# EAGLE board homeboard28 (EAGLE 6.0)
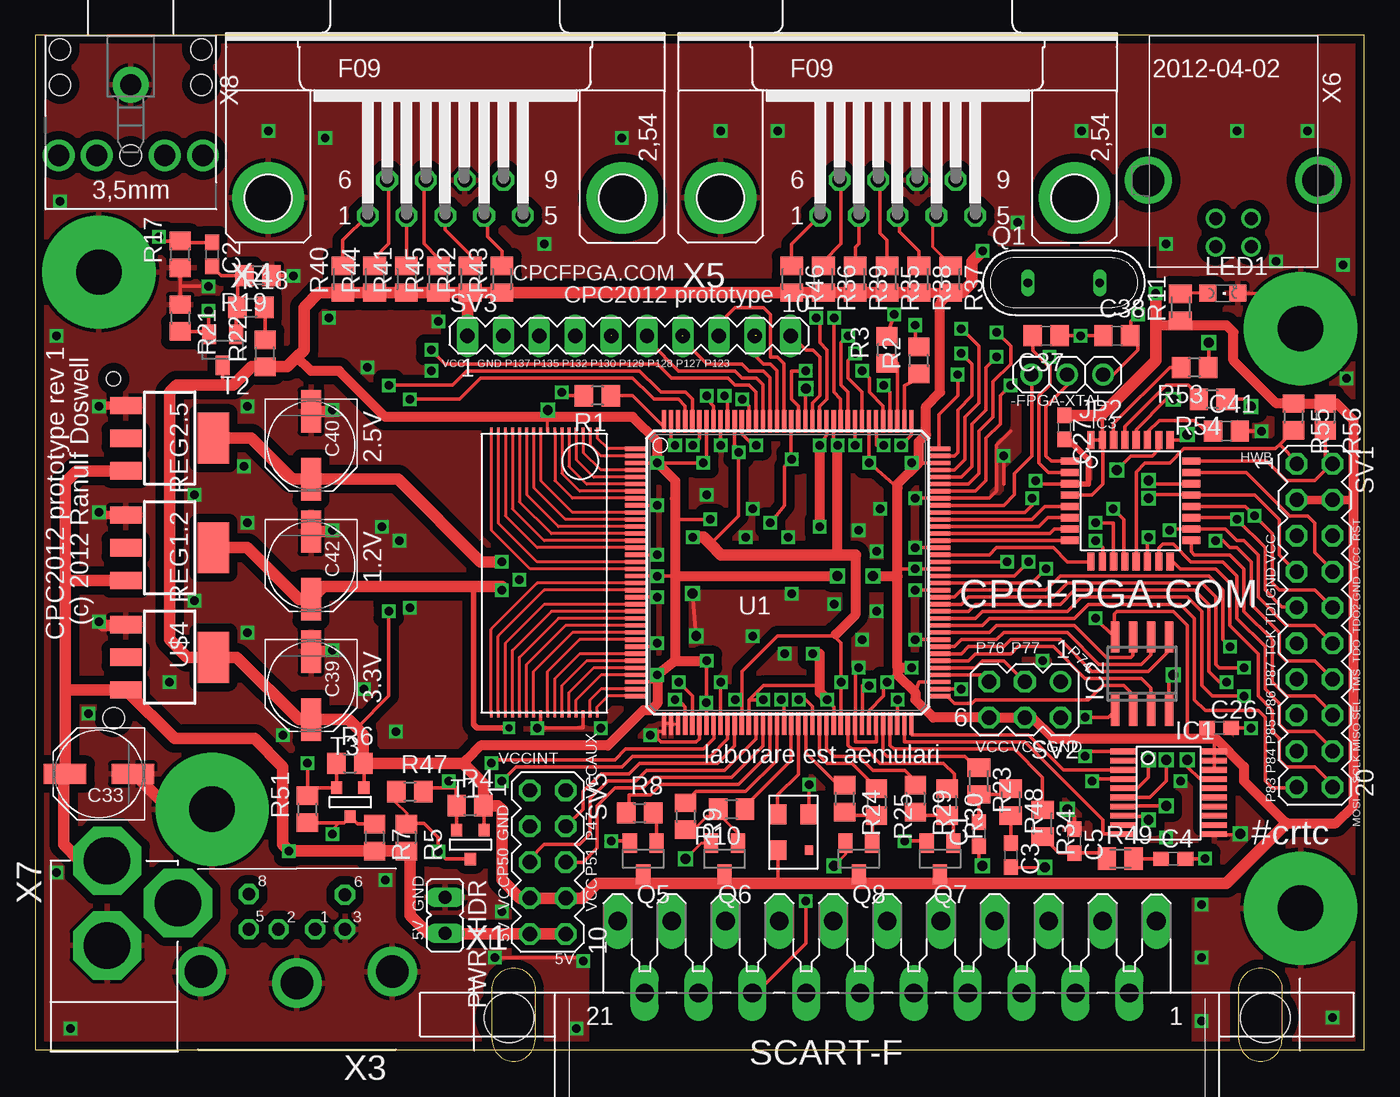
[diagram p3: board, top side]
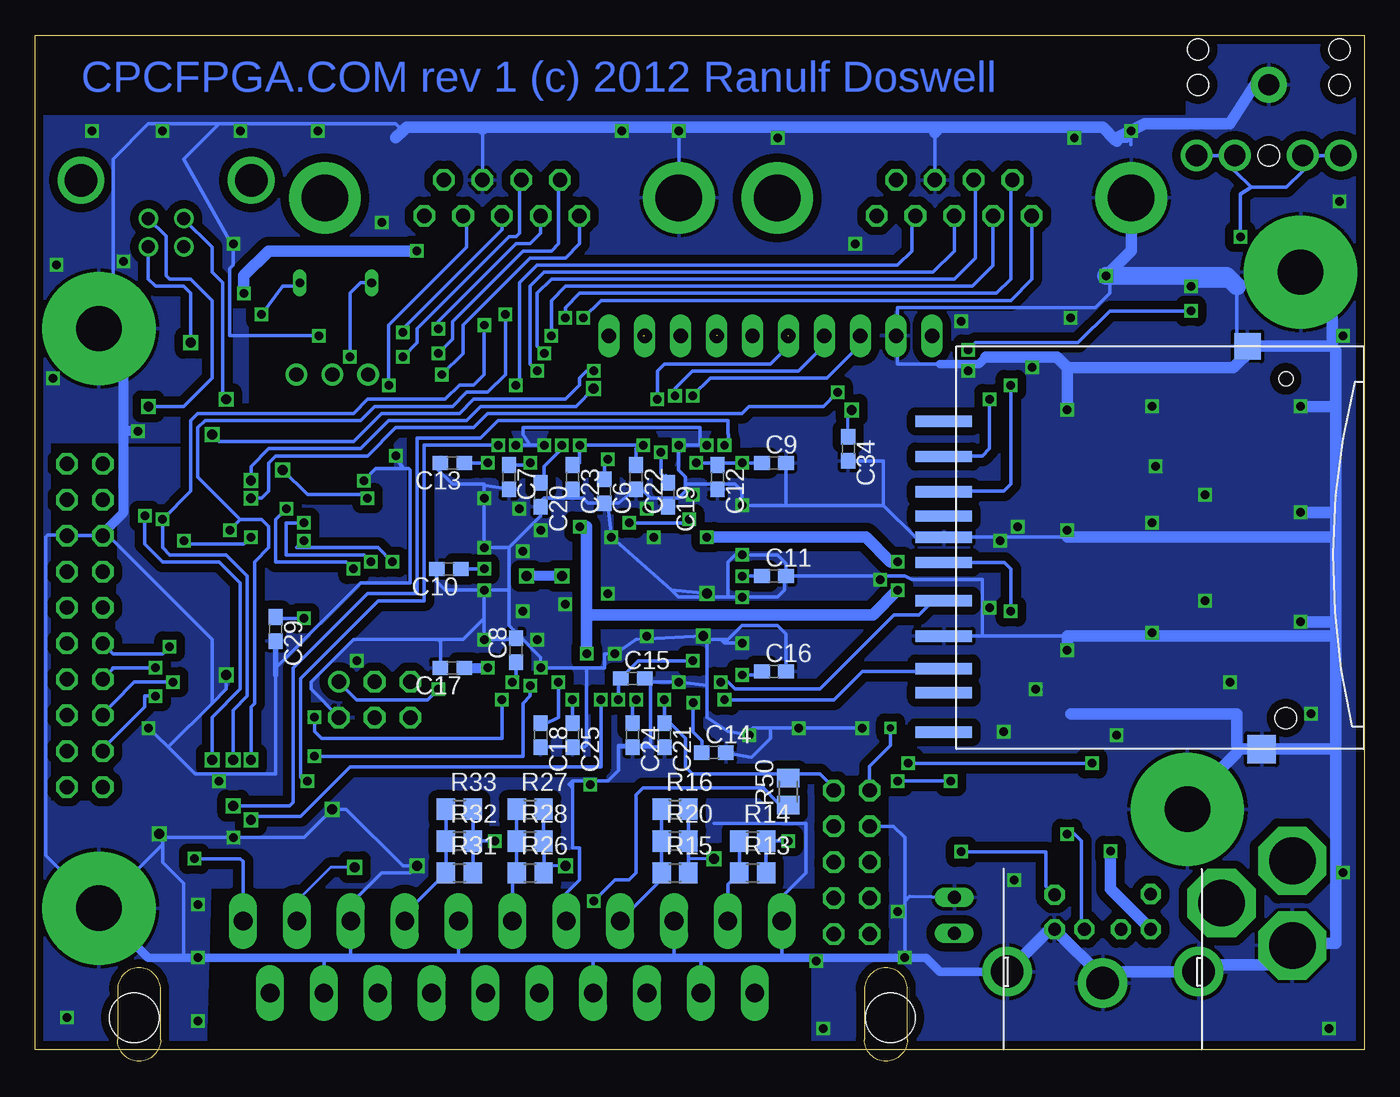
[diagram p4: board, bottom side, seen from below]

Size 94 x 72.58 mm. Coordinates in mm from the lower left corner, seen from the top.
Outline: 0,0.83 94,0.83 94,72.58 0,72.58 0,0.83
Copper layers (1*16): Top 0.0356mm / dielectric 1.5011mm / Bottom 0.0356mm
Design rules: minimum track width 7mil, minimum drill 15mil, track to track 7mil, track to pad 7mil, pad to pad 7mil, via to via 7mil, smd to smd 7mil, copper to edge 15mil, drill to drill 15mil, minimum pad ring 7mil, minimum via ring 7mil, stop-mask expansion 4mil, vias tented up to drill 0mil, thermal gap 10mil
Net classes: 1 power: width 0.6 mm, drill 1.1 mm, clearance 0.4 mm; 2 gnd: width 0.305 mm, drill 0.508 mm, clearance 0.152 mm

## Footprints (pad centres in the part's own frame; a part is rotated, then mirrored left to right if it is on the bottom)
C0603 = smd 1.1 x 1: 1 -0.85,0; 2 0.85,0
PANASONIC_D = smd 3 x 1.4: + 2.4,0; - -2.4,0
C0805 = smd 1.3 x 1.5: 1 -0.95,0; 2 0.95,0
VO20 = smd 0.4 x 1.8: 1 5.85,6.15; 2 5.2,6.15; 3 4.55,6.15; 4 3.9,6.15; 5 3.25,6.15; 6 2.6,6.15; 7 1.95,6.15; 8 1.3,6.15; 9 0.65,6.15; 10 0,6.15; 11 0,-0.3; 12 0.65,-0.3; 13 1.3,-0.3; 14 1.95,-0.3; 15 2.6,-0.3; 16 3.25,-0.3; 17 3.9,-0.3; 18 4.55,-0.3; 19 5.2,-0.3; 20 5.85,-0.3
SO-08 = smd 0.6 x 2.2: 1 -1.905,-2.6; 2 -0.635,-2.6; 3 0.635,-2.6; 4 1.905,-2.6; 5 1.905,2.6; 6 0.635,2.6; 7 -0.635,2.6; 8 -1.905,2.6
TQFP32-08 = smd 1.27 x 0.508: 1 -4.293,2.8; 2 -4.293,2; 3 -4.293,1.2; 4 -4.293,0.4; 5 -4.293,-0.4; 6 -4.293,-1.2; 7 -4.293,-2; 8 -4.293,-2.8; 17 4.293,-2.8; 18 4.293,-2; 19 4.293,-1.2; 20 4.293,-0.4; 21 4.293,0.4; 22 4.293,1.2; 23 4.293,2; 24 4.293,2.8 | smd 0.508 x 1.27: 9 -2.8,-4.293; 10 -2,-4.293; 11 -1.2,-4.293; 12 -0.4,-4.293; 13 0.4,-4.293; 14 1.2,-4.293; 15 2,-4.293; 16 2.8,-4.293; 25 2.8,4.293; 26 2,4.293; 27 1.2,4.293; 28 0.4,4.293; 29 -0.4,4.293; 30 -1.2,4.293; 31 -2,4.293; 32 -2.8,4.293
1X03 = drill 1.016: 1 -2.54,0; 2 0,0; 3 2.54,0
CHIPLED_0805 = smd 1.2 x 1.2: A 0,-1.05; C 0,1.05
JP1 = drill 0.914 long: 1 0,-1.27; 2 0,1.27
QS = drill 0.61 long: 1 -2.54,0; 2 2.54,0
SOT23 = smd 1 x 1.4: 1 -0.95,-1.1; 2 0.95,-1.1; 3 0,1.1
R0805 = smd 1.3 x 1.5: 1 -0.95,0; 2 0.95,0
M0805 = smd 1.3 x 1.6: 1 -0.95,0; 2 0.95,0
SOT223 = smd 1.219 x 2.235: 1 -2.311,-3.099; 2 0,-3.099; 3 2.311,-3.099 | smd 3.6 x 2.2: 4 0,3.099
MA10-2 = drill 1.016 octagon: 1 -11.43,-1.27; 2 -11.43,1.27; 3 -8.89,-1.27; 4 -8.89,1.27; 5 -6.35,-1.27; 6 -6.35,1.27; 7 -3.81,-1.27; 8 -3.81,1.27; 9 -1.27,-1.27; 10 -1.27,1.27; 11 1.27,-1.27; 12 1.27,1.27; 13 3.81,-1.27; 14 3.81,1.27; 15 6.35,-1.27; 16 6.35,1.27; 17 8.89,-1.27; 18 8.89,1.27; 19 11.43,-1.27; 20 11.43,1.27
MA03-2 = drill 1.016: 1 -2.54,-1.27 | drill 1.016 octagon: 2 -2.54,1.27; 3 0,-1.27; 4 0,1.27; 5 2.54,-1.27; 6 2.54,1.27
MA10-1 = drill 1.016 long: 1 -11.43,0; 2 -8.89,0; 3 -6.35,0; 4 -3.81,0; 5 -1.27,0; 6 1.27,0; 7 3.81,0; 8 6.35,0; 9 8.89,0; 10 11.43,0
MA05-2 = drill 1.016 octagon: 1 -5.08,-1.27; 2 -5.08,1.27; 3 -2.54,-1.27; 4 -2.54,1.27; 5 0,-1.27; 6 0,1.27; 7 2.54,-1.27; 8 2.54,1.27; 9 5.08,-1.27; 10 5.08,1.27
SOT-23 = smd 0.787 x 0.889: 1 0.025,-1.016; 2 -0.94,1.016; 3 0.991,1.016
TQ144 = smd 1.6 x 0.3: P1 -10.7,8.75; P2 -10.7,8.25; P3 -10.7,7.75; P4 -10.7,7.25; P5 -10.7,6.75; P6 -10.7,6.25; P7 -10.7,5.75; P8 -10.7,5.25; P9 -10.7,4.75; P10 -10.7,4.25; P11 -10.7,3.75; P12 -10.7,3.25; P13 -10.7,2.75; P14 -10.7,2.25; P15 -10.7,1.75; P16 -10.7,1.25; P17 -10.7,0.75; P18 -10.7,0.25; P19 -10.7,-0.25; P20 -10.7,-0.75; P21 -10.7,-1.25; P22 -10.7,-1.75; P23 -10.7,-2.25; P24 -10.7,-2.75; P25 -10.7,-3.25; P26 -10.7,-3.75; P27 -10.7,-4.25; P28 -10.7,-4.75; P29 -10.7,-5.25; P30 -10.7,-5.75; P31 -10.7,-6.25; P32 -10.7,-6.75; P33 -10.7,-7.25; P34 -10.7,-7.75; P35 -10.7,-8.25; P36 -10.7,-8.75; P73 10.7,-8.75; P74 10.7,-8.25; P75 10.7,-7.75; P76 10.7,-7.25; P77 10.7,-6.75; P78 10.7,-6.25; P79 10.7,-5.75; P80 10.7,-5.25; P81 10.7,-4.75; P82 10.7,-4.25; P83 10.7,-3.75; P84 10.7,-3.25; P85 10.7,-2.75; P86 10.7,-2.25; P87 10.7,-1.75; P88 10.7,-1.25; P89 10.7,-0.75; P90 10.7,-0.25; P91 10.7,0.25; P92 10.7,0.75; P93 10.7,1.25; P94 10.7,1.75; P95 10.7,2.25; P96 10.7,2.75; P97 10.7,3.25; P98 10.7,3.75; P99 10.7,4.25; P100 10.7,4.75; P101 10.7,5.25; P102 10.7,5.75; P103 10.7,6.25; P104 10.7,6.75; P105 10.7,7.25; P106 10.7,7.75; P107 10.7,8.25; P108 10.7,8.75 | smd 0.3 x 1.6: P37 -8.75,-10.7; P38 -8.25,-10.7; P39 -7.75,-10.7; P40 -7.25,-10.7; P41 -6.75,-10.7; P42 -6.25,-10.7; P43 -5.75,-10.7; P44 -5.25,-10.7; P45 -4.75,-10.7; P46 -4.25,-10.7; P47 -3.75,-10.7; P48 -3.25,-10.7; P49 -2.75,-10.7; P50 -2.25,-10.7; P51 -1.75,-10.7; P52 -1.25,-10.7; P53 -0.75,-10.7; P54 -0.25,-10.7; P55 0.25,-10.7; P56 0.75,-10.7; P57 1.25,-10.7; P58 1.75,-10.7; P59 2.25,-10.7; P60 2.75,-10.7; P61 3.25,-10.7; P62 3.75,-10.7; P63 4.25,-10.7; P64 4.75,-10.7; P65 5.25,-10.7; P66 5.75,-10.7; P67 6.25,-10.7; P68 6.75,-10.7; P69 7.25,-10.7; P70 7.75,-10.7; P71 8.25,-10.7; P72 8.75,-10.7; P109 8.75,10.7; P110 8.25,10.7; P111 7.75,10.7; P112 7.25,10.7; P113 6.75,10.7; P114 6.25,10.7; P115 5.75,10.7; P116 5.25,10.7; P117 4.75,10.7; P118 4.25,10.7; P119 3.75,10.7; P120 3.25,10.7; P121 2.75,10.7; P122 2.25,10.7; P123 1.75,10.7; P124 1.25,10.7; P125 0.75,10.7; P126 0.25,10.7; P127 -0.25,10.7; P128 -0.75,10.7; P129 -1.25,10.7; P130 -1.75,10.7; P131 -2.25,10.7; P132 -2.75,10.7; P133 -3.25,10.7; P134 -3.75,10.7; P135 -4.25,10.7; P136 -4.75,10.7; P137 -5.25,10.7; P138 -5.75,10.7; P139 -6.25,10.7; P140 -6.75,10.7; P141 -7.25,10.7; P142 -7.75,10.7; P143 -8.25,10.7; P144 -8.75,10.7
GNDHOLE = drill 3.2 pad 8: GND 0,0
OSC_7C = smd 0.7 x 0.6: ENA -1.27,-1.1 | smd 1.4 x 1.2: GND 1.27,-1.1; OUT 1.27,1.1; VDD -1.27,1.1
SDCARD-NOHOLE = smd 0.8 x 4 bottom: 1 7.8,0.99; 2 10.3,0.99; 3 13.5,0.99; 4 15.3,0.99; 5 18,0.99; 6 20.5,0.99; 7 22.8,0.99; 8 24.5,0.99; 9 5.3,0.99; CD 12,0.99; WP 27.3,0.99 | smd 2.032 x 2.032 bottom: MT1 28.5,-21.5 | smd 1.9 x 1.9 bottom: MT3 0,-20.5 | hole 1.5: 26.3,-23.21 | hole 1: 2.3,-23.21
TSOP32 = smd 0.5 x 0.2: P1 -9.75,3.75; P2 -9.75,3.25; P3 -9.75,2.75; P4 -9.75,2.25; P5 -9.75,1.75; P6 -9.75,1.25; P7 -9.75,0.75; P8 -9.75,0.25; P9 -9.75,-0.25; P10 -9.75,-0.75; P11 -9.75,-1.25; P12 -9.75,-1.75; P13 -9.75,-2.25; P14 -9.75,-2.75; P15 -9.75,-3.25; P16 -9.75,-3.75; P17 10.25,-3.75; P18 10.25,-3.25; P19 10.25,-2.75; P20 10.25,-2.25; P21 10.25,-1.75; P22 10.25,-1.25; P23 10.25,-0.75; P24 10.25,-0.25; P25 10.25,0.25; P26 10.25,0.75; P27 10.25,1.25; P28 10.25,1.75; P29 10.25,2.25; P30 10.25,2.75; P31 10.25,3.25; P32 10.25,3.75
SCART-CLIP = drill 1.321 long: 1 19.05,5.08; 2 17.145,0; 3 15.24,5.08; 4 13.335,0; 5 11.43,5.08; 6 9.525,0; 7 7.62,5.08; 8 5.715,0; 9 3.81,5.08; 10 1.905,0; 11 0,5.08; 12 -1.905,0; 13 -3.81,5.08; 14 -5.715,0; 15 -7.62,5.08; 16 -9.525,0; 17 -11.43,5.08; 18 -13.335,0; 19 -15.24,5.08; 20 -17.145,0; 21 -19.05,5.08 | hole 3.5: 26.75,-1.75; -26.75,-1.75
M_DIN6 = drill 0.9 pad 1.422 octagon: 1 -1.3,-3.75; 2 1.3,-3.75; 3 -3.4,-3.75; 5 3.4,-3.75; 6 -3.4,-6.2; 8 3.4,-6.25 | drill 2.3 pad 3.5: SH1 6.8,-0.75; SH2 0,0.05; SH3 -6.75,-0.75
F09HP = drill 1.016 octagon: 1 -5.486,-1.27; 2 -2.743,-1.27; 3 0,-1.27; 4 2.743,-1.27; 5 5.486,-1.27; 6 -4.115,1.27; 7 -1.372,1.27; 8 1.372,1.27; 9 4.115,1.27 | drill 3.302 pad 5.08: G1 -12.522,0; G2 12.522,0
85-32004-10X = drill 0.92 pad 1.27: 1 4.71,-1.25; 2 4.71,1.25; 3 2.71,1.25; 4 2.71,-1.25 | drill 2.3 pad 3: M1 0,6.02; M2 0,-6.02
DC-21MM = drill 3.302 pad 4.826 octagon: 1 -5.08,-3.353; 2 -0.076,-6.35; 3 -0.076,-0.356
20-0137 = drill 1.5 pad 2.54: 1 -5,0 | drill 1.5: 2 0,5.1; 3 0,2.4; 4 0,-2.4; 5 0,-5.1 | hole 1.5: -5,5; -5,-5; 0,0; -7.5,5; -7.5,-5

## Placement (x,y rotation side)
C1  [C0603]  66.75,16.08 90 top
C2  100nF  [C0603]  12.5,57.08 270 top
C3  [C0603]  69,14.58 270 top
C4  [C0603]  80.5,14.33 0 top
C5  [C0603]  73.5,15.58 270 top
C6  100nF  [C0603]  53.75,40.33 270 bottom
C7  100nF  [C0603]  60.5,41.33 270 bottom
C8  100nF  [C0603]  60,29.08 90 bottom
C9  100nF  [C0603]  41.75,42.33 0 bottom
C10  100nF  [C0603]  64.75,34.83 180 bottom
C11  100nF  [C0603]  41.75,34.33 0 bottom
C12  100nF  [C0603]  45.75,41.33 270 bottom
C13  100nF  [C0603]  64.5,42.33 180 bottom
C14  100nF  [C0603]  46,21.83 0 bottom
C15  100nF  [C0603]  51.75,27.08 0 bottom
C16  100nF  [C0603]  41.75,27.58 0 bottom
C17  100nF  [C0603]  64.5,27.83 180 bottom
C18  100nF  [C0603]  58.25,23.08 270 bottom
C19  100nF  [C0603]  49.25,40.08 270 bottom
C20  100nF  [C0603]  58.25,40.08 270 bottom
C21  100nF  [C0603]  49.5,23.08 270 bottom
C22  100nF  [C0603]  51.5,41.33 270 bottom
C23  100nF  [C0603]  56,41.33 270 bottom
C24  100nF  [C0603]  51.75,23.08 270 bottom
C25  100nF  [C0603]  56,23.08 270 bottom
C26  100nF  [C0603]  83.75,23.58 0 top
C27  100nF  [C0603]  72.8,44.84 270 top
C29  100nF  [C0603]  77,30.58 270 bottom
C33  100u  [PANASONIC_D]  4.5,20.33 180 top
C34  100nF  [C0603]  36.5,43.33 270 bottom
C37  [C0805]  71.5,51.33 180 top
C38  [C0805]  76.5,51.33 0 top
C39  100u  [PANASONIC_D]  19.5,26.58 270 top
C40  100u  [PANASONIC_D]  19.5,43.58 270 top
C41  1uF  [C0805]  84.25,44.58 0 top
C42  100u  [PANASONIC_D]  19.5,35.08 270 top
IC1  XCF02S  [VO20]  83.09,16.06 90 top
IC2  25LC080SN  [SO-08]  78.28,27.41 0 top
IC3  ATMEGA32U2-TQFP  [TQFP32-08]  77.47,39.65 0 top
JP2  [1X03]  73,48.58 180 top
LED1  [CHIPLED_0805]  84,54.33 270 top
PWR_HDR  [JP1]  29,10.33 180 top
Q1  [QS]  72.75,55.08 0 top
Q5  BC848SMD  [SOT23]  43,14.33 180 top
Q6  BC848SMD  [SOT23]  48.75,14.33 180 top
Q7  BC848SMD  [SOT23]  64,14.33 180 top
Q8  BC848SMD  [SOT23]  58.25,14.33 180 top
R1  100  [R0805]  39.76,47.07 180 top
R2  100  [R0805]  62.5,49.58 90 top
R3  100  [R0805]  60.25,50.33 90 top
R4  1000  [R0805]  30.75,18.08 0 top
R5  1000  [R0805]  26.25,15.83 270 top
R6  1000  [R0805]  22.25,21.08 0 top
R7  1000  [R0805]  24,15.83 270 top
R8  2200  [R0805]  42.75,17.58 0 top
R9  2200  [R0805]  46,17.33 270 top
R10  1000  [R0805]  49.25,17.83 180 top
R11  [M0805]  81,53.33 90 top
R13  680  [R0805]  43.25,13.33 0 bottom
R14  2200  [R0805]  43.25,15.58 0 bottom
R15  270  [R0805]  48.75,13.33 0 bottom
R16  680  [R0805]  48.75,17.83 0 bottom
R17  10000  [R0805]  10.25,57.08 90 top
R18  4700  [R0805]  15.25,53.33 0 top
R19  10000  [R0805]  15.75,55.58 180 top
R20  4700  [R0805]  48.75,15.58 0 bottom
R21  47000  [R0805]  10.25,52.58 270 top
R22  1000  [R0805]  16.25,50.08 90 top
R23  [M0805]  66.75,19.83 270 top
R24  2200  [R0805]  57.25,18.58 270 top
R25  1000  [R0805]  59.5,18.33 270 top
R26  270  [R0805]  59,13.33 0 bottom
R27  680  [R0805]  59,17.83 0 bottom
R28  4700  [R0805]  59,15.58 0 bottom
R29  2200  [R0805]  62.25,18.58 270 top
R30  1000  [R0805]  64.5,18.33 270 top
R31  270  [R0805]  64,13.33 0 bottom
R32  680  [R0805]  64,15.58 0 bottom
R33  4700  [R0805]  64,17.83 0 bottom
R34  [M0805]  71.25,16.83 270 top
R35  [M0805]  60.25,55.33 270 top
R36  [M0805]  55.75,55.33 270 top
R37  [M0805]  64.75,55.33 270 top
R38  [M0805]  62.5,55.33 270 top
R39  [M0805]  58,55.33 270 top
R40  [M0805]  21.75,55.33 90 top
R41  [M0805]  26.25,55.33 90 top
R42  [M0805]  30.75,55.33 90 top
R43  [M0805]  33,55.33 90 top
R44  [M0805]  24,55.33 90 top
R45  [M0805]  28.5,55.33 90 top
R46  [M0805]  53.5,55.33 270 top
R47  270  [R0805]  26.5,19.08 0 top
R48  [M0805]  69,18.33 270 top
R49  [M0805]  76.75,14.33 0 top
R50  2k2  [M0805]  40.75,19.08 90 bottom
R51  270  [R0805]  19.25,17.83 90 top
R53  22  [R0805]  82,49.08 180 top
R54  22  [R0805]  83.25,46.83 180 top
R55  4700  [R0805]  89,45.58 270 top
R56  4700  [R0805]  91.25,45.58 270 top
REG1.2  1.2V  [SOT223]  9.5,36.33 270 top
REG2.5  2.5V  [SOT223]  9.5,44.08 270 top
SV1  [MA10-2]  90.5,30.83 270 top
SV2  [MA03-2]  70,25.58 180 top
SV3  [MA10-1]  42,51.33 0 top
SV5  [MA05-2]  36.25,14.08 270 top
T1  BSS138  [SOT-23]  30.75,15.33 0 top
T2  BC848  [SOT23]  13.25,50.33 180 top
T3  BSS138  [SOT-23]  22.25,18.33 0 top
U1  XC3S400TQ144  [TQ144]  53.22,34.58 0 top
U$1  GNDHOLE  [GNDHOLE]  12.5,17.83 0 top
U$2  TXO_7C  [OSC_7C]  53.62,16.2 90 top
U$3  SDMMCNOHOLE  [SDCARD-NOHOLE]  28.75,50.58 270 top
U$4  3.3V  [SOT223]  9.5,28.58 270 top
U$6  AS6C4008  [TSOP32]  36,34.83 270 top
U$7  GNDHOLE  [GNDHOLE]  4.5,55.83 0 top
U$8  GNDHOLE  [GNDHOLE]  89.5,51.83 0 top
U$9  GNDHOLE  [GNDHOLE]  89.5,10.83 0 top
X1  SCART-CLIP  [SCART-CLIP]  60.25,4.83 0 top
X3  [M_DIN6]  18.5,5.58 180 top
X4  [F09HP]  29,61.08 0 top
X5  [F09HP]  61,61.08 0 top
X6  MINI-USB_4P-85-32004-10X  [85-32004-10X]  84.75,62.33 270 top
X7  DC21MMX  [DC-21MM]  5,7.83 180 top
X8  STEREOJACK  [20-0137]  6.75,64.08 270 top

## Tracks (layer width: path | path; a pad name or v marks a point on that pad's centre or on a via)
AT_CLKO  (via drill 0.7)
  Top 0.254: v78.75,41.08 79,40.83 81.74,40.83 IC3.22 | U1.P124 54.47,47.55 v54.5,47.58
  Bottom 0.254: v78.75,41.08 78.75,42.08 77.5,43.33 71,43.33 69,45.33 63.5,45.33 62.5,46.33 55.75,46.33 v54.5,47.58
AT_RESET
  Top 0.254: IC3.24 87.13,42.45 88.5,41.08 90.5,41.08 91.75,42.33 | 91.75,42.33 91.75,42.28 SV1.2 | R56.2 91.25,42.83 91.75,42.33
B0
  Top 0.254: U1.P63 57.47,22.36 57.75,22.08 58.75,22.08 59.75,21.08 64.25,21.08 65,20.33 65,19.53 R30.1
B1
  Top 0.254: U1.P60 55.97,22.11 56.5,21.58 58.25,21.58 59.25,20.58 61.5,20.58 62.25,19.83 R29.1
CASIN  (via drill 0.6)
  Top 0.254: R21.2 12.1,51.63 T2.2 12.3,51.63 12.5,51.83 12.25,51.83 v12.25,53.08 | U1.P131 50.97,47.36 50.5,47.83 49.5,47.83 49,48.33 45,48.33 44,49.33 29,49.33 v28,50.33
  Bottom 0.254: v12.25,53.08 18,53.08 20.25,50.83 27.5,50.83 v28,50.33
CLK16
  Top 0.254: U1.P56 53.97,20.3 52.5,18.83 52.5,17.5 U$2.OUT
CLK_5V  (via drill 0.6)
  Top 0.2: 26.3,16.83 26.3,17.53 25.5,18.33 25.5,19.03 R47.1
  Top 0.254: T1.1 29.02,14.31 v28.5,14.83 28.5,15.83 27.5,16.83 26.3,16.83 R5.1
  Bottom 0.254: v28.5,14.83 22.5,14.83 22.5,12.38 X3.6
CSYNC
  Top 0.254: U1.P52 51.97,21.8 49.75,19.58 44.25,19.58 43.5,18.83 42,18.83 42,17.78 R8.1
DATA_5V  (via drill 0.6)
  Top 0.2: v21,16.08 21,16.38 21.5,16.88
  Top 0.254: R7.1 22.81,16.78 T3.1 21.84,16.88 21.5,16.88 R51.1
  Bottom 0.254: v21,16.08 20.5,16.08 20,15.58 20,9.53 X3.1
EMER_BOOT
  Top 0.254: SV1.1 89.23,42.4 88.05,43.58 88.05,43.68 | 88.05,43.68 R55.2 | IC3.13 77.87,41.7 78.5,42.33 80.25,42.33 81.25,43.33 87.7,43.33 88.05,43.68
EXP_A
  Top 0.254: U1.P47 49.47,22.3 48.25,21.08 42.75,21.08 42,20.33 40,20.33 38.75,19.08 38.75,17.83 37.52,16.6 SV5.4
EXP_B
  Top 0.254: U1.P50 50.97,22.8 48.75,20.58 43.25,20.58 42.5,19.83 40.5,19.83 39.25,18.58 39.25,16.08 38.5,15.33 36,15.33 34.98,14.31 SV5.5
EXP_C
  Top 0.254: U1.P51 51.47,22.3 49.25,20.08 43.75,20.08 43,19.33 41,19.33 39.75,18.08 39.75,15.08 38.75,14.08 SV5.6
EXTCLK
  Top 0.254: U1.P100 68.5,39.33 69.25,40.08 69.25,41.58 70.5,42.83 70.5,48.58 JP2.3
FL_DI
  Top 0.254: U1.P79 65.5,28.83 66,29.33 68.5,29.33 69,29.83 72.5,29.83 74.75,27.58 78.75,27.58 80.19,29.01 IC2.5
FL_DO
  Top 0.254: IC2.2 77.64,25.93 77,26.58 75.5,26.58 74.5,25.58 66.5,25.58 66.25,25.33 65,25.33 64.5,25.83 U1.P73
FL_HOLD
  Top 0.254: U1.P82 67.5,30.33 68,30.83 73.5,30.83 75.75,28.58 77.5,28.58 77.64,28.72 IC2.7
FL_SCLK
  Top 0.254: U1.P80 65,29.33 65.5,29.83 68,29.83 68.5,30.33 73,30.33 75.25,28.08 78.25,28.08 78.92,28.74 IC2.6
FL_SEL  (via drill 0.6)
  Top 0.254: v74.25,24.33 75.89,24.33 IC2.1 | v61,25.58 61,23.91 U1.P70
  Bottom 0.254: v74.25,24.33 74.25,23.33 73.75,22.83 61,22.83 v61,25.58
FL_WP
  Top 0.254: U1.P78 66,28.33 66.5,28.83 69,28.83 69.5,29.33 72,29.33 74.25,27.08 78.25,27.08 78.92,26.41 IC2.3
FPGA_AUDIO_LEFT
  Top 0.254: U1.P68 59.97,21.86 60.25,21.58 65.75,21.58 66.55,20.78 R23.1
FPGA_AUDIO_RIGHT
  Top 0.254: U1.P69 60.47,22.36 60.75,22.08 69.25,22.08 71.25,20.08 R34.1
G0
  Top 0.254: U1.P59 55.47,21.61 56,21.08 57.75,21.08 59,19.83 R25.1
G1
  Top 0.254: U1.P57 54.5,23.85 54.5,21.83 56.75,19.58 R24.1
GND  (via drill 0.6, 0.7)
  Top 0.2: U1.P37 U1.P38 U1.P39 | IC1.11 85.24,16.06 v85.25,16.08 | LED1.C 87,54.33 U$8.GND
  Top 0.254: U1.P9 v44,39.33 | U1.P22 v44,32.83 | U1.P16 v44,35.83 | U1.P81 v62.25,29.83 | U1.P88 v62.25,33.33 | U1.P94 v62.25,36.33 | U1.P117 57.97,43.86 v58,43.58 | v60,43.58 59.5,43.58 59.5,45.33 59.47,45.3 U1.P114 | U$6.P30 38.75,23.58 35.75,23.58 | U$6.P24 35.75,23.58 | 35.75,23.58 v35.5,23.58 | 44,23.33 v43.5,23.08 | U1.P29 43.75,29.33 v44,29.58 | U1.P42 46.97,22.8 46.75,22.58 44.25,22.58 44,22.83 44,23.33 | U1.P67 59.5,23.88 59.5,22.58 58,22.58 58,23.91 | v58.25,27.83 58,27.83 58,23.91 | 58,23.91 U1.P64 | R17.1 10.25,56.08 | R21.1 10.25,54.83 | 10.25,54.83 10.25,56.08 | 10.25,56.08 10,56.33 | R19.1 v18.25,55.58 | v12.25,54.83 10.25,54.83 | v62.25,39.83 U1.P101 67.5,39.83 68,40.33 68,43.58 69,44.58 | C38.1 v73.95,51.33 C37.1 | v70.75,41.08 71,40.83 73.15,40.83 IC3.3 73.23,40.85 73.25,40.83 | U1.P37 44.47,23.86 44.5,23.83 44.5,23.33 44,23.33 | U1.P39 45.47,23.86 45.5,23.83 | 68.5,40.83 v68.5,42.83 | U1.P45 48.47,26.55 v48.5,26.83 | U1.P136 48.47,43.86 v48.5,43.58 | 7,20.33 C33.- | 46.97,45.3 U1.P139 46.97,44.05 v46.5,43.58 | U$2.GND 54.73,19.55 v54.75,19.58 | v46.75,30.08 v46.5,33.08 | C5.1 73.5,17.33 v73,17.83 | IC2.4 80.19,27.01 v80.5,27.33 | C26.2 v86,23.58 | C1.1 66.75,14.08 v67,13.83 | v86.75,44.58 85.25,44.58 | 85.25,44.58 85,44.83 | C41.2 85.25,44.58 | v32.5,7.33 38.5,7.33 v38.75,7.08
  Top 0.406: C27.2 73.09,43.99 74.5,42.58 74.5,40.83 73.25,40.83
  Top 0.6: 6,30.83 6.4,30.83 U$4.1
  Top 0.61: REG2.5.1 4.56,46.39 v4.5,46.33 | REG1.2.1 4.69,38.64 v4.5,38.83
  Top 0.8: C39.- 20.5,28.98 v21,29.08 | C42.- 21,37.48 v21,37.58 | C40.- 21,45.98 v21,46.08 | U$1.GND 9.5,17.83 7,20.33
  Top 0.813: 6,30.83 4.75,30.83 v4.5,31.08
  Bottom 0.2: 25.5,6.33 X3.SH3 | 22.25,9.33 X3.3 | 18.5,5.93 X3.SH2 | v85.25,16.08 85,15.83 | 85,14.08 85,14.33
  Bottom 0.254: v62.25,33.33 62.15,33.23 | 62.25,31.33 v62.25,29.83 60.1,29.83 C8.2 | 62.25,31.33 v62.25,33.33 | 47,43.58 v48.5,43.58 48.5,41.83 48,41.33 48,40.93 | 47,43.58 v46.5,43.58 | 56,39.83 55.25,39.83 54.9,39.48 C6.2 | v58,43.58 59,43.58 | 59,43.58 v60,43.58 | 34,39.33 34,42.48 C34.2 | 47,43.58 47,44.83 59.5,44.83 59.5,44.33 59,43.58 | 60.5,33.33 v62.25,33.33 | v44,32.83 45,32.83 45,35.33 44.5,35.83 v44,35.83 41.5,35.83 40.9,35.23 C11.2 32.5,34.33 32,34.08 27,34.08 27,30.08 | 60.5,36.33 v62.25,36.33 v62.25,39.83 62.25,40.83 | v35.5,23.58 42,23.58 | 42,23.58 43.25,23.58 v43.5,23.08 45,23.33 46.5,24.33 46.5,26.58 | U$3.6 27,30.08 | 27,30.08 21,30.08 | 21,37.08 U$3.3 31.75,37.08 34,39.33 | v44,29.58 45.25,29.58 45.5,29.83 | 56,19.83 56,15.08 55.5,15.08 55.5,12.83 56.5,11.83 56.44,11.77 X1.13 | v12.25,54.83 9,54.83 9,51.33 U$3.MT3 | 81,66.33 83.5,63.83 80,57.58 80,56.33 80.25,56.08 80.25,51.33 v73.95,51.33 | 81,66.33 68.5,66.33 68,65.83 | 85,15.33 85,15.83 75,15.83 v73,17.83 72,17.83 68,13.83 v67,13.83 67.5,13.33 69.5,13.33 71.68,11.15 X1.5 71.68,7.65 | 85,15.33 85,14.08 83.5,12.58 83.5,7.33 | 30,49.33 33,49.33 33,51.33 SV3.2 33,51.44 33,53.33 19,53.33 18,54.33 18,55.33 v18.25,55.58 | X5.G1 48.48,66.05 | X4.8 30.37,65.45 31,66.08 | X5.8 62.37,65.95 | 81,66.33 86,66.33 88.5,63.83 88.5,51.33 U$8.GND | 77,27.33 77,20.33 82.7,20.33 84.6,22.23 | SV2.2 72.54,24.37 74.5,26.33 74.5,26.83 71.5,29.83 65.5,29.83 | 65.5,29.83 63.75,29.83 62.25,31.33 | v70.75,41.08 69.91,41.91 68,41.91 | 68,41.91 67.59,41.91 67.5,41.83 67.5,33.83 71,33.83 77,27.83 | v68.5,42.83 68,41.91 | 52.4,22.23 C24.2 C21.2 52.65,22.23 52.75,22.33
  Bottom 0.254: 55,27.83 55,22.33 55.15,22.23 C25.2 C18.2 | 52.75,22.33 52.75,20.58 53.5,19.83 54.75,19.83 | 52.75,22.33 50.5,22.33 50.5,26.83 | C16.2 40.9,30.23 41.5,30.83 44,30.83 45,29.83 45.5,29.83 | C10.2 65.6,33.93 65,33.33 v62.25,33.33 | C17.2 65.35,29.68 65.5,29.83 | 62.25,40.83 64.5,40.83 65.6,41.93 65.6,42.23 65.5,42.33 C13.2 | C14.2 43.35,21.48 42,22.83 42,23.58 | 46.5,29.83 v46.75,30.08 51.5,29.83 v53,28.83 53.75,28.83 53.75,27.83 55,27.83 | 46.5,29.83 45.5,29.83 | C15.2 50.5,26.83 | 50.5,26.83 v48.5,26.83 46.5,26.58 | 46.5,26.58 46.5,29.83 | 41,34.33 41,33.33 41.5,32.83 48.5,32.83 49,33.33 | C9.2 40.9,39.43 41,39.33 | 41,39.33 v44,39.33 44,40.33 44.5,40.83 45.65,40.83 C12.2 46.1,40.83 47.9,40.83 48,40.93 | 34,39.33 41,39.33 | 55,27.83 v58.25,27.83 58.25,28.58 59.5,29.83 60,29.83 | C7.2 62.15,40.73 62.25,40.83 | C23.2 56,39.83 | 48,40.93 48,40.33 48.5,39.83 49.5,39.83 | 9,21.83 9,22.08 | 17.5,65.33 17.62,65.2 | SV5.3 33.29,16.62 32.5,15.83 32.5,11.33 | 32.5,11.33 v32.5,7.33 | PWR_HDR.1 32.18,11.65 32.5,11.33 | 84.6,22.23 81.5,25.33 | 81.5,25.33 80.5,26.33 v80.5,27.33 | v86,23.58 84.7,22.33 84.6,22.23 | C19.2 49.4,39.73 49.5,39.83 | v54.75,19.58 54.75,19.83 | 17.5,65.08 16.75,65.08 16.5,65.33 16.5,64.83 | 60.5,36.33 60.5,33.33 | 60.5,33.33 60.5,30.83 60,30.33 | 49.5,39.83 50.5,39.83 51.5,40.83 C22.2 52.75,39.48 C6.2 | C20.2 58.25,38.58 60.5,36.33 | 56,39.83 58,39.83 58.5,39.33 58,39.33 | 49,33.33 v53.25,37.08 53.5,39.23 C6.2 | v46.5,33.08 49,33.33 | 85,15.33 U$9.GND 93.25,14.58 93.25,37.08 93.11,37.22 91.81,37.22 SV1.6 SV1.5 | 41,7.33 41.2,7.53 X1.21 41.2,11.63 39.5,13.33 39.5,16.83 46,16.83 | X1.18 46.91,7.24 47,7.33
  Bottom 0.254: X1.17 48.82,7.51 49,7.33 | X1.14 54.53,7.29 54.5,7.33 | X1.9 64.06,7.39 64,7.33 | X1.4 73.58,7.24 73.5,7.33 | 81.5,25.33 81.5,29.83 89,37.33 | 89.25,37.33 89.25,37.08 | 54.75,19.83 56,19.83 | 56,19.83 56.25,19.58 56,19.33
  Bottom 0.406: 77,27.33 77,27.83 C29.2
  Bottom 0.6: 4.93,8.33 X7.3 | 25.5,6.33 30,6.33 31,7.33 v32.5,7.33 41,7.33 47,7.33 49,7.33 54.5,7.33 64,7.33 73.5,7.33 83.5,7.33 86,7.33 U$9.GND | 26.75,49.83 27.25,49.33 30,49.33
  Bottom 0.61: 2,36.83 2,37.08
  Bottom 0.7: 89.25,37.33 87.75,38.83 87.75,44.58 | 87.75,44.58 87.75,49.58 U$8.GND | v86.75,44.58 87.75,44.58
  Bottom 0.8: 2,30.83 2,36.83 2,38.83 | X3.SH3 22.25,9.33 | X3.3 18.5,5.93 | X3.SH2 17.7,6.33 X3.SH1 11.2,6.83 6.43,6.83 X7.3 | 30.37,65.7 30,66.08 | 30,66.08 18.5,66.08 17.62,65.2 17.5,65.08 | 2,30.08 21,30.08 v21,29.08 | 2,37.08 21,37.08 v21,37.58 | v21,46.08 21,49.08 | 7.5,22.33 7.5,22.08 9,22.08 9,24.58 20.75,24.58 | U$1.GND 12.5,18.33 9,21.83 | 2,46.33 2,50.33 2.25,50.58 | 2,46.33 2,38.83 | v4.5,46.33 2,46.33 | v4.5,38.83 2,38.83 | 2.5,31.08 2.25,31.08 2,30.83 | 2,30.83 2,30.08 | U$3.MT1 2,22.08 | 2,22.08 2,30.08 | 4.93,8.33 2,8.33 2,22.08 | U$3.MT3 2.25,50.58 | 2.25,50.58 2.25,52.58 U$7.GND | 21,49.08 9.25,49.08 8,50.33 | 26.75,49.83 21.75,49.83 21,49.08 | X4.G1 16.48,57.35 v18.25,55.58 | X8.1 7.75,69.08 9.5,66.33 15.5,66.33 17.5,65.33 | 30,66.08 31,66.08 48.5,66.08 | 48.5,66.08 62.5,66.08 | 62.5,66.08 67.75,66.08 68,65.83 68.5,65.33 | 62.37,65.95 62.5,66.08 | 48.48,66.05 48.5,66.08
  Bottom 0.813: U$3.MT1 9,22.08 | v4.5,31.08 2.5,31.08
  Bottom 1.27: v18.25,55.58 9.75,55.58 9,54.83
  other vias: 15,38.08 85,65.83 82.5,2.83 26.5,32.08 2.5,2.33 59.5,36.08 59.5,31.83 71.25,28.33 41.5,65.33 74,65.83 15,30.33 15,46.33 9.5,26.83 23.5,49.08 47.5,40.08 56.5,32.33 34.25,34.08 25.5,23.33 81,19.83 20.5,65.33 52.5,65.83 24.5,37.83 87.75,56.58 69.5,59.33 80,57.83 36,57.83 20.75,52.58 92.75,48.33 59.75,39.08 53.5,33.08 50.75,30.08 92.5,56.33 90,65.83 79.5,65.83 48.5,65.83 16.5,65.83 38.25,2.33 1.5,13.33 91.75,3.08 1.75,60.83 82.5,7.33 50.75,39.08 80,15.83 82.5,11.08 40,23.58 3.75,24.58 28,48.83 50.25,37.08 28.5,52.33 14.75,42.08 11.25,40.08 11.25,32.58 17.5,23.08 23.25,26.33 25.75,36.83 1.5,51.33 24.75,12.83 33,10.58 58.25,37.58 58.5,29.83
  pour Bottom (isolate 0.6): 0,72.83 12.5,72.83 12.5,66.83 94,66.83 94,16.33 93,16.33 93,43.83 79,43.83 79,57.33 66,57.33 66,51.33 68.5,51.33 68.5,41.83 70,41.83 71,40.83 76,40.83 76,43.33 88,43.33 88.5,12.33 56,12.33 56,19.83 54.5,19.83 54.5,26.33 53.5,26.33 53.5,19.83 51.5,19.83 51.5,12.33 39,12.33 39,20.33 0,20.33
  pour Bottom (isolate 0.6): -0.5,0.33 -0.5,23.33 33.5,23.33 33.5,7.33 39,7.33 39,0.83 82,0.83 81.5,18.33 94.5,18.33 94.5,0.83
  pour Top (isolate 0.6): 0,72.83 94.5,72.83 94.5,43.83 79.5,43.83 79.5,57.83 66.5,57.83 66.5,46.33 70,46.33 70,41.83 55.5,41.83 55.5,53.33 28.5,53.33 28.5,48.83 53.5,48.83 53.5,44.83 -0.5,44.83 -0.5,72.83
  pour Top (isolate 0.6): -0.5,1.33 -0.5,49.33 69,49.33 69,40.33 74.5,40.33 74.5,45.83 88,45.83 88,26.33 85,26.33 85,20.83 85.5,20.83 85.5,19.83 88,19.83 88,15.33 67.5,15.33 67.5,22.83 81,22.83 81,28.33 66,28.33 66,12.83 56.5,12.83 56.5,19.33 54.5,19.33 54.5,25.33 51,25.33 51,12.83 39,12.83 39,20.33 33.5,20.33 33.5,7.33 39,7.33 39,1.33
  pour Top (isolate 0.6): 94.5,0.83 94.5,17.83 82,17.83 82,0.83
HDR_MISO  (via drill 0.6)
  Top 0.254: v84.25,26.83 83.75,26.83 83,27.58 83,32.33 82,33.33 73.5,33.33 72.5,32.33 66.5,32.33 66,31.83 U1.P85
  Bottom 0.254: v84.25,26.83 87,26.83 88.5,25.33 88.97,24.83 89.23,24.57 SV1.15
HDR_MOSI
  Top 0.254: 89.07,19.4 89.25,19.58 | U1.P83 67,30.83 67.5,31.33 73.5,31.33 74.5,32.33 81,32.33 82,31.33 82,25.58 82.75,24.83 86.5,24.83 87,24.33 87,19.83 87.5,19.33 89,19.33 89.07,19.4 | SV1.19 89.07,19.4
HDR_SCLK  (via drill 0.6)
  Top 0.254: v85.5,25.83 83.25,25.83 82.5,26.58 82.5,31.83 81.5,32.83 74,32.83 73,31.83 67,31.83 66.5,31.33 U1.P84
  Bottom 0.254: v85.5,25.83 86.25,25.83 86.25,25.08 89.23,22.1 SV1.17
HDR_SEL  (via drill 0.6)
  Top 0.254: v85.5,27.83 83.75,27.83 83.5,28.08 83.5,32.83 82.5,33.83 73,33.83 72,32.83 66,32.83 65.5,32.33 U1.P86
  Bottom 0.254: v85.5,27.83 88.51,27.83 88.51,27.74 SV1.13
HDR_SPARE  (via drill 0.6)
  Top 0.254: v84.5,29.33 84,29.83 84,33.33 83,34.33 72.5,34.33 71.5,33.33 65.5,33.33 65,32.83 U1.P87
  Bottom 0.254: v84.5,29.33 85,28.83 88.5,28.83 SV1.11 89.25,29.58
JOY0_DOWN  (via drill 0.6)
  Top 0.254: U1.P118 57.47,47.36 57,47.83 57,50.83 v57.5,51.33 | R41.2 X4.2
  Bottom 0.254: v57.5,51.33 57.5,53.83 56.5,54.83 27.7,54.83 R41.2 X4.2
JOY0_FIRE1  (via drill 0.6)
  Top 0.254: U1.P116 58.47,47.36 57.5,48.33 57.5,49.58 v58,50.08 | R45.2 28.5,56.83 27.5,57.83 27.5,62.22 X4.7
  Bottom 0.254: v58,50.08 58.5,50.58 58.5,54.33 57.5,55.33 29,55.33 27.5,56.83 27.5,62.22 X4.7
JOY0_FIRE2  (via drill 0.6)
  Top 0.254: U1.P119 56.97,46.86 56.5,47.33 v56.5,52.58 | R44.2 24,56.83 25,57.83 25,62.23 X4.6
  Bottom 0.254: v56.5,52.58 56.5,53.33 55.5,54.33 26,54.33 25,55.33 25,62.23 X4.6
JOY0_LEFT  (via drill 0.6)
  Top 0.254: U1.P113 59.97,46.36 59,47.33 59,48.33 v58.5,48.83 | R42.2 30.75,57.08 29,58.83 X4.3
  Bottom 0.254: v58.5,48.83 59,49.33 59,54.83 58,55.83 30.5,55.83 29,57.33 X4.3
JOY0_RIGHT  (via drill 0.6)
  Top 0.254: U1.P112 60.47,47.36 v60,47.83 | R43.2 33,57.33 32,58.33 32,59.55 X4.4
  Bottom 0.254: v60,47.83 59.75,47.83 59.75,55.08 58.5,56.33 33,56.33 32,57.33 32,59.55 X4.4
JOY0_UP  (via drill 0.6)
  Top 0.254: U1.P122 55.47,46.3 56,46.83 56,50.33 55.5,50.83 55.5,52.33 v55.25,52.58 | R40.2 21.75,58.08 23.5,59.83 X4.1
  Bottom 0.254: v55.25,52.58 54,53.83 25,53.83 23.5,55.33 23.5,59.79 X4.1
JOY1_DOWN  (via drill 0.6)
  Top 0.254: U1.P105 65,41.83 65.75,42.58 65.75,45.58 66.75,46.58 66.75,50.58 v65.5,51.83 | R39.1 58,57.58 58.25,57.83 X5.2
  Bottom 0.254: X5.2 58.26,58.58 59.01,57.83 60,57.83 65.5,52.33 v65.5,51.83
JOY1_FIRE1  (via drill 0.6)
  Top 0.254: U1.P104 65.5,41.33 66.25,42.08 66.25,45.08 67.25,46.08 67.25,49.08 v68,49.83 | R35.1 60.25,58.08 59.75,58.58 59.75,62.22 X5.7
  Bottom 0.254: X5.7 59.75,62.22 59.75,58.58 60,58.33 60.5,58.33 67,51.83 67,50.83 v68,49.83
JOY1_FIRE2  (via drill 0.6)
  Top 0.254: R36.1 55.75,56.58 57,57.83 57,62.23 X5.6 | U1.P107 65,42.83 65.25,43.08 65.25,46.08 66.25,47.08 66.25,49.33 v65.5,50.08
  Bottom 0.254: X5.6 57,62.23 57,57.83 57.5,57.33 59.5,57.33 64.5,52.33 64.5,51.08 v65.5,50.08
JOY1_LEFT  (via drill 0.6)
  Top 0.254: U1.P103 66,40.83 66.75,41.58 66.75,44.58 67.75,45.58 67.75,48.08 69,49.33 69,50.58 v68,51.58 | R38.1 62.5,57.33 61.12,58.7 61.12,59.68 X5.3
  Bottom 0.254: 61,59.83 X5.3 61,58.83 68,51.83 v68,51.58
JOY1_RIGHT  (via drill 0.6)
  Top 0.2: R37.1 64.75,56.33 63.5,57.58 63.5,59.56 X5.4
  Top 0.254: U1.P102 66.5,40.33 67.25,41.08 67.25,44.08 68.25,45.08 68.25,47.08 v69,47.83
  Bottom 0.254: X5.4 63.5,59.56 63.5,57.58 69,52.08 v69,47.83
JOY1_UP  (via drill 0.6)
  Top 0.254: 55.5,59.83 X5.1 53.5,57.79 R46.1 | U1.P108 63.92,45.75 65.25,47.08 v65.25,48.58
  Bottom 0.254: X5.1 55.5,59.79 55.5,57.83 56.5,56.83 59,56.83 63.75,52.08 63.75,50.08 v65.25,48.58
N$1  (via drill 0.6)
  Top 0.254: U1.P135 48.97,46.86 v48.75,47.08
  Bottom 0.254: v48.75,47.08 48.75,47.58 47.5,48.83 40,48.83 38.25,50.58 38.25,51.27 SV3.4
N$2  (via drill 0.6)  (1 unrouted)
  Top 0.254: U1.P132 50.47,46.36 v50,46.83
  Bottom 0.254: v50,46.83 50,48.83 49.5,49.33 42,49.33 41,50.33 41,51.08 40.75,51.33
N$3  (via drill 0.6)
  Top 0.254: U1.P137 47.97,46.36 47.5,46.83 v47.5,47.08
  Bottom 0.254: v47.5,47.08 46.25,48.33 38,48.33 35.5,50.83 35.5,51.18 SV3.3
N$4
  Top 0.254: U1.P130 51.47,47.86 51,48.33 50,48.33 49.5,48.83 45.5,48.83 43.5,50.83 43.5,51.1 SV3.6
N$5  (1 unrouted)
  Top 0.254: U1.P129 51.97,48.36 51.5,48.83 50.5,48.83 50,49.33 47.5,49.33 46,50.83 46,51.08 45.75,51.33
N$6  (1 unrouted)
  Top 0.254: U1.P128 52.47,48.86 52,49.33 51.5,49.33 51,49.83 51,51.33
N$7
  Top 0.254: U1.P127 52.97,49.36 52.5,49.83 52,49.83 52,52.83 51.5,53.33 49.5,53.33 48.5,52.33 48.5,51.48 SV3.8
N$8
  Top 0.254: 72.88,42.45 IC3.1 71.88,42.45 71.5,42.83 71.5,46.33 73,47.83 JP2.2
N$9
  Top 0.254: IC3.27 78.67,44.5 79.5,45.33 82,45.33 82.75,44.58 C41.1
N$10
  Top 0.2: LED1.A 81,54.33 R11.2
N$12  (via drill 0.6)
  Top 0.254: v71.75,49.83 71.75,49.08 | C37.2 70.55,50.28 71.75,49.08 | IC3.2 71.68,41.65 71,42.33 71,47.08 71.75,47.83 71.75,49.08
  Bottom 0.254: Q1.1 71,55.08 71.75,54.33 v71.75,49.83
N$14  (via drill 0.6)
  Top 0.254: v78,52.83 77.5,52.38 C38.2 78,51.28 78,50.33 76.25,48.58 JP2.1
  Bottom 0.254: Q1.2 75.54,54.83 76.5,54.83 v78,52.83
N$16
  Top 0.254: U1.P123 54.97,46.55 55.5,47.08 55.5,49.83 55,50.33 54.5,50.33 53.5,51.33 SV3.10
N$35
  Top 0.254: U1.P72 61.97,23.86 62,23.83 62,23.08 70.25,23.08 72.71,20.61 IC1.3
N$36  (via drill 0.7)
  Top 0.254: R53.1 83,49.13 v83,50.83
  Bottom 0.254: X6.2 86,55.33 85.5,54.83 83.5,54.83 83,54.33 v83,50.83
N$38
  Top 0.254: U1.P71 61.47,22.61 61.5,22.58 70,22.58 75.5,17.08 75.5,16.08 76.75,16.08 76.76,16.06 IC1.10
N$39
  Top 0.254: U1.P110 61.47,47.8 62.5,48.33 R2.1
N$40  (via drill 0.6, 0.7)
  Top 0.254: IC1.7 77,18.08 77,18.07 IC1.7 77.01,18.08 v80,18.08 | U1.P143 44.97,43.8 v45.25,43.58
  Bottom 0.254: v45.25,43.58 44.97,43.86 44.97,44.33 45,44.36 45,45.33 61.25,45.33 62.5,44.08 67,44.08 67,33.08 70.5,33.08 75.75,27.83 75.75,18.33 76,18.08 v80,18.08
N$42
  Top 0.254: U1.P144 44.47,44.86 42.25,47.08 40.75,47.08 40.71,47.04 | R1.1 40.71,47.04 | 40.71,47.04 40.5,46.83
N$43
  Top 0.254: U1.P111 60.97,49.41 R3.1
N$49
  Top 0.254: IC3.29 77.07,44.9 80,47.83 81.55,47.83 82.3,47.08 R54.2
N$50
  Top 0.254: REG2.5.2 6.65,44.33
N$51
  Top 0.254: C1.2 R23.2 68.6,18.88 R48.1
N$52
  Top 0.254: C3.1 R48.2
N$53
  Top 0.2: 46.3,16.38 46.55,16.38 47.5,17.33 47.8,17.33 R10.2 | 49.7,15.88 49.7,16.13 48.5,17.33 48.5,17.63
  Top 0.254: R9.2 46.3,16.38 | Q6.1 49.7,15.88 | 48.5,17.63 R10.2
N$54  (via drill 0.7)
  Top 0.2: Q6.2 47.1,15.43 v46,14.33
  Top 0.254: Q6.2 47.6,15.43
  Bottom 0.2: v46,14.33 47.8,14.33
  Bottom 0.254: R16.2 R20.2 47.8,14.33 R15.2
N$55
  Top 0.254: R24.2 57,17.38 R25.2 59.2,17.18 Q8.1
N$56  (via drill 0.7)
  Top 0.2: Q8.2 57.3,14.63 v56.5,13.83
  Top 0.254: Q8.2 57.05,14.88
  Bottom 0.2: v56.5,13.83 58,13.83
  Bottom 0.254: R27.2 R28.2 58.05,15.78 58,15.83 58,13.83 58,13.38 R26.2
N$57
  Top 0.254: Q7.1 64.95,17.08 R30.2 62.95,17.38 62.5,17.83 62.45,17.83 R29.2
N$58  (via drill 0.6)
  Top 0.254: v61.5,15.58 62.9,15.58 Q7.2
  Bottom 0.254: R31.2 R32.2 | R32.2 R33.2 | R32.2 v61.5,15.58
N$59  (via drill 0.6)
  Top 0.254: v40.75,15.58 41.65,15.58 Q5.2
  Bottom 0.254: R13.2 R14.2 v40.75,15.58
N$60
  Top 0.254: C2.2 13.15,55.58 R19.2 14.3,55.08 R18.1 14.2,53.23 T2.1
N$61  (via drill 0.6)
  Top 0.254: C2.1 9.85,57.93 R17.2 9.05,58.03 v8.75,58.33
  Bottom 0.254: 12,63.93 X8.2 X8.3 9.15,62.98 8,61.83 | X8.5 X8.4 4.35,62.98 5.5,61.83 8,61.83 | v8.75,58.33 8.75,61.33 8,61.83
N$62
  Top 0.254: R22.2 16.25,53.08 | 16.25,53.08 16.5,53.33 | R18.2 16.2,53.13 16.25,53.08
N$63
  Top 0.254: Q5.1 43.95,17.33 R8.2
N$64
  Top 0.254: C4.1 R49.2
N$65
  Top 0.254: R34.2 72.4,14.73 C5.2 75.4,14.73 R49.1
N$66  (via drill 0.7)
  Top 0.254: R54.1 85.5,46.83 v86,46.33
  Bottom 0.254: X6.3 84.75,58.37 84.75,55.58 84.5,55.33 83,55.33 81.5,53.83 81.5,48.33 83.5,46.33 v86,46.33
N$67
  Top 0.2: U$6.P1 39.75,44.08 40.5,43.33 U1.P1
N$68
  Top 0.254: IC3.30 76.27,45.1 80.25,49.08 R53.2
N$69  (via drill 0.7)
  Top 0.254: IC3.28 77.87,44.7 80,46.83 v80.5,46.83
  Bottom 0.254: v80.5,46.83 80.5,47.08 80.75,47.33 80.75,55.08 81.5,55.83 81.5,57.58 83.5,59.58 X6.4
N$71
  Top 0.2: U$6.P2 39.25,43.58 40,42.83 U1.P2
N$72
  Top 0.2: U$6.P3 38.75,43.08 40,41.83 U1.P4
N$73
  Top 0.2: U$6.P4 38.25,42.58 39.5,41.33 U1.P5
N$74
  Top 0.2: U$6.P5 37.75,42.08 39,40.83 U1.P6
N$75
  Top 0.2: U$6.P6 37.25,41.58 38.5,40.33 U1.P7
N$76
  Top 0.2: U$6.P7 36.75,41.08 38,39.83 U1.P8
N$77
  Top 0.2: U$6.P9 35.75,41.08 38,38.83 U1.P10
N$78
  Top 0.2: U$6.P10 35.25,40.58 37.5,38.33 U1.P11
N$79
  Top 0.2: U$6.P11 34.75,40.08 37,37.83 U1.P12
N$80
  Top 0.2: U$6.P12 34.25,39.58 36.5,37.33 U1.P13
N$81
  Top 0.2: U$6.P13 33.75,39.08 36,36.83 U1.P14
N$82
  Top 0.2: U$6.P14 33.25,38.58 35.5,36.33 U1.P15
N$83
  Top 0.2: U$6.P15 32.75,38.08 35.5,35.33 U1.P17
N$84
  Top 0.2: U$6.P16 32.25,37.58 35,34.83 U1.P18
N$85
  Top 0.2: U$6.P17 32.25,30.58 35.5,33.83 U1.P20
N$86
  Top 0.2: U$6.P18 32.75,30.08 36,33.33 U1.P21
N$87
  Top 0.2: U$6.P19 33.25,29.58 36,32.33 U1.P23
N$88
  Top 0.2: U$6.P20 33.75,29.08 36.5,31.83 U1.P24
N$89
  Top 0.2: U$6.P21 34.25,28.58 37,31.33 U1.P25
N$90
  Top 0.2: U$6.P22 34.75,28.08 37.5,30.83 U1.P26
N$91
  Top 0.2: U$6.P23 35.25,27.58 38,30.33 U1.P27
N$92
  Top 0.2: U$6.P25 36.25,27.58 38.5,29.83 U1.P28
N$93
  Top 0.2: U$6.P26 36.75,27.08 38.5,28.83 U1.P30
N$94
  Top 0.2: U$6.P27 37.25,26.58 39,28.33 U1.P31
N$95
  Top 0.2: U$6.P28 37.75,26.08 39.5,27.83 U1.P32
N$96
  Top 0.2: U$6.P29 38.25,25.58 40,27.33 U1.P33
N$97
  Top 0.2: U$6.P31 39.25,25.58 40,26.33 U1.P35
N$98
  Top 0.2: U$6.P32 39.75,25.08 40.5,25.83 U1.P36
PC2
  Top 0.254: U1.P98 70.5,38.33 71.42,39.25 IC3.5
PC4  (via drill 0.6, 0.7)
  Top 0.254: U1.P99 70,38.83 70.5,39.33 v70.5,39.83 | IC3.26 79.47,43.3 79,42.83 77.5,42.83 v76.5,41.83
  Bottom 0.254: v70.5,39.83 70.5,40.08 74.75,40.08 v76.5,41.83
PC5  (via drill 0.6, 0.7)
  Top 0.254: U1.P125 53.97,46.36 53.5,46.83 53.5,48.83 v54.5,48.83 | IC3.25 81.12,43.94 v81.5,44.33
  Bottom 0.254: v54.5,48.83 55,48.83 55.5,48.33 55.5,47.83 56.5,46.83 63,46.83 64,45.83 69.5,45.83 71.5,43.83 81,43.83 v81.5,44.33
PD0
  Top 0.254: U1.P97 71,37.83 71.62,38.45 IC3.6
PD1
  Top 0.254: U1.P96 71.75,37.33 72.07,37.65 IC3.7
PD2
  Top 0.254: U1.P95 73.15,36.83 IC3.8
PD3
  Top 0.254: U1.P93 67.5,35.83 68,36.33 72,36.33 73,35.33 74.64,35.33 IC3.9
PD4  (via drill 0.6)
  Top 0.254: v75,36.83 75.5,36.33 75.5,35.39 IC3.10 | U1.P92 v68.75,35.33
  Bottom 0.254: v75,36.83 75.5,36.33 69.75,36.33 v68.75,35.33
PD5  (via drill 0.6)
  Top 0.254: 76.25,35.59 IC3.11 76.25,35.34 | v75,38.08 76.25,38.08 76.25,35.34 | U1.P90 69.25,34.33 v70.25,35.33 | 76.25,35.33 76.25,35.34
  Bottom 0.254: v75,38.08 76.25,38.08 76.25,35.83 70.75,35.83 v70.25,35.33
PD6  (via drill 0.6)
  Top 0.254: v76.25,39.08 77,38.33 77,35.43 IC3.12 | U1.P89 70.5,33.83 v71.5,34.83
  Bottom 0.254: v76.25,39.08 77,38.33 77,35.33 72,35.33 v71.5,34.83
PROM_DO  (via drill 0.6)
  Top 0.254: U1.P65 58.5,23.35 58.5,26.58 v59,26.58 | IC1.1 74.59,21.91 v74.25,21.58
  Bottom 0.254: v59,26.58 59,25.83 59.5,25.33 59.5,21.58 v74.25,21.58
PROM_INITB  (via drill 0.6, 0.7)
  Top 0.254: U1.P58 54.97,25.11 54.5,25.58 v54,25.58 | v78.75,17.08 78.5,17.33 76.98,17.33 IC1.8
  Bottom 0.254: v54,25.58 54,20.83 71.75,20.83 75.25,17.33 78.5,17.33 v78.75,17.08
PS2CLK  (via drill 0.6)
  Top 0.254: U1.P46 48.97,22.8 47.75,21.58 42.25,21.58 41.5,20.83 34,20.83 v33,19.83 | v29.25,19.83 29.75,19.33 | 29.75,19.33 27.7,19.33 R47.2 | 29.75,19.33 29.75,18.13 R4.1 T1.2
  Bottom 0.254: v33,19.83 v29.25,19.83
PS2DAT  (via drill 0.6)
  Top 0.254: U1.P44 48,23.85 48,22.83 47.25,22.08 41.75,22.08 41,21.33 32.5,21.33 v32.25,21.08 | R6.1 T3.2 21.29,19.33 19.25,19.33 | R6.1 | v19.25,21.08 19.25,19.33 | 19.25,19.33 R51.2 | R6.1 20.99,21.07
  Bottom 0.254: v32.25,21.08 v19.25,21.08
R0
  Top 0.254: U1.P55 53.47,21.3 50.2,18.03 R10.1
R1
  Top 0.254: U1.P53 52.47,21.3 50.25,19.08 46.75,19.08 46,18.33 R9.1
SCART_BLANKING  (via drill 0.6)
  Top 0.254: v54.5,11.33 54.5,8.33 51.25,5.08 50.98,5.08 X1.16
  Bottom 0.254: v54.5,11.33 53,12.83 52,12.83 51.5,13.33 51.5,18.83 51,19.33 42.5,19.33 41.5,18.33 40.95,18.33 R50.1
SCART_BLUE
  Bottom 0.254: R33.1 R32.1 R31.1 67.87,10.41 X1.7
SCART_COMP
  Bottom 0.254: R14.1 R13.1 45.01,12.52 X1.19
SCART_GREEN
  Bottom 0.254: R27.1 R28.1 R26.1 60.25,13.03 X1.11
SCART_LEFT  (via drill 0.7)
  Top 0.2: C3.2 v71.4,13.73
  Bottom 0.2: v71.4,13.73 73.1,13.73 75.5,11.33
  Bottom 0.254: X1.3 75.49,11.32 75.5,11.33
SCART_RED
  Bottom 0.254: R16.1 R20.1 R15.1 50,13.03 50,12.58 52.63,9.95 X1.15
SCART_RIGHT  (via drill 0.6)
  Top 0.254: C4.2 v82.75,14.33
  Bottom 0.254: v82.75,14.33 79.5,14.33 79.3,14.13 X1.1
SD_CLK  (via drill 0.6)
  Top 0.254: U1.P41 46.5,23.88 46.5,25.83 v45.5,26.83
  Bottom 0.254: v45.5,26.83 45,26.83 44.5,26.33 38.5,26.33 33.25,31.58 31.5,31.58 30.5,32.58 U$3.5
SD_CS  (via drill 0.6)
  Top 0.254: v26.5,46.83 30,46.83 31.5,48.33 42.25,48.33 43.5,47.08 43.75,46.83 45.5,46.83 45.97,46.36 U1.P141
  Bottom 0.254: U$3.1 29.69,42.83 27,42.83 26.5,43.33 v26.5,46.83
SD_DI  (via drill 0.6)
  Top 0.254: v25,47.83 29.5,47.83 30.5,48.83 42.75,48.83 44,47.58 44.25,47.33 46,47.33 46.47,46.86 U1.P140
  Bottom 0.254: U$3.2 29.69,40.33 25.5,40.33 25,40.83 v25,47.83
SD_DO  (via drill 0.6)
  Top 0.254: U1.P40 45.97,25.05 45.75,25.33 v45.25,25.58
  Bottom 0.254: v45.25,25.58 37.5,25.58 35.5,27.58 29.94,27.58 U$3.7
SPI_MISO
  Top 0.254: IC3.17 81.76,36.06 82,35.83 84.5,35.83 85.5,34.83 85.5,31.83 87.5,29.83 87.5,26.83 88.5,25.83 90.5,25.83 91.77,24.56 SV1.16
SPI_MOSI
  Top 0.254: IC3.16 80.47,35.36 81,34.83 83.5,34.83 84.5,33.83 84.5,30.83 86.5,28.83 86.5,25.83 87.5,24.83 87.5,23.33 88,22.83 88,21.33 88.5,20.83 90.5,20.83 91.77,19.56 SV1.20
SPI_SCLK
  Top 0.254: IC3.15 79.47,36.3 79.75,36.58 80.5,36.58 81.75,35.33 84,35.33 85,34.33 85,31.33 87,29.33 87,26.33 88,25.33 88,23.83 88.5,23.33 90.5,23.33 91.77,22.06 SV1.18
SPI_SEL  (via drill 0.6)
  Top 0.254: v83.5,36.83 84,36.83 84.5,36.33 85,36.33 86,35.33 86,32.33 88,30.33 88,28.83 88.5,28.33 90.5,28.33 91.77,27.06 SV1.14 | IC3.14 78.67,37 v78.75,37.08
  Bottom 0.254: v83.5,36.83 83.5,36.58 79.25,36.58 v78.75,37.08
TCK  (via drill 0.6, 0.7)
  Top 0.254: R2.2 62.25,50.83 v62.25,52.08 | IC3.19 84.87,38.45 v85,38.33 87,36.33 87,33.33 88.19,32.14 89.19,32.14 SV1.9 | IC1.6 78.84,18.66 80,19.83 v80,21.33
  Bottom 0.254: v62.25,52.08 62.25,48.58 63,47.83 64,47.83 65,46.83 70.5,46.83 71.5,45.83 82.5,45.83 83,45.33 83,40.33 v85,38.33 85,36.33 84.5,35.83 80.5,35.83 79,34.33 79,25.83 80,24.83 v80,21.33
TDI_FPGA  (via drill 0.6, 0.7)
  Top 0.254: 39,47.08 R1.2 37.5,47.08 v37.25,47.33 | SV1.7 89.25,34.62 89.25,34.58 88,35.83 88,38.33 86.28,40.05 IC3.21 81.73,40.08 79,40.08 v78.75,39.83
  Bottom 0.254: v37.25,47.33 38.25,46.33 43.5,46.33 44,45.83 62,45.83 63,44.83 68.5,44.83 70.5,42.83 77,42.83 77.5,42.33 77.5,40.33 78,39.83 v78.75,39.83
TDO_EXP
  Top 0.254: IC3.23 85.68,41.65 88.75,38.58 90,38.58 90.5,38.08 90.5,36 91.77,34.73 SV1.8
TDO_FPGA  (via drill 0.6)
  Top 0.254: U1.P109 61.97,44.3 v61.25,43.58 | IC1.4 75.14,19.96 v74.75,19.83
  Bottom 0.254: v61.25,43.58 66.5,43.58 66.5,32.58 69.75,32.58 75.25,27.08 75.25,20.08 v74.75,19.83
TDO_PROM  (via drill 0.6, 0.7)
  Top 0.254: IC1.17 82.36,19.96 81.5,20.83 v81.5,21.33 | IC3.20 85.58,39.25 v86.25,38.58 87.5,37.33 87.5,33.83 88,33.33 90.5,33.33 91.73,32.1 SV1.10
  Bottom 0.254: v86.25,38.58 86.25,36.58 85,35.33 81,35.33 79.5,33.83 79.5,26.33 81.5,24.33 v81.5,21.33
TMS  (via drill 0.6, 0.7)
  Top 0.254: R3.2 v60.75,52.83 | v80.25,37.58 80.68,37.65 IC3.18 84.18,37.65 85,36.83 85.5,36.83 86.5,35.83 86.5,32.83 88.5,30.83 90.5,30.83 SV1.12 | v78.75,21.33 78.75,20.08 78,19.33 76.96,19.33 IC1.5
  Bottom 0.254: v60.75,52.83 60.75,48.58 62,47.33 63.5,47.33 64.5,46.33 70,46.33 71,45.33 82,45.33 82.5,44.83 82.5,41.33 79.5,38.33 | v78.75,21.33 78.75,25.08 78.5,25.33 78.5,35.33 77.5,36.33 77.5,37.83 78,38.33 79.5,38.33 | 79.5,38.33 v80.25,37.58
VCC  (via drill 0.6, 0.7)
  Top 0.2: U$6.P8 36.25,45.33 36,45.58 | v36.25,46.08 36.25,45.58 | 81,51.83 81,52.08 R11.1
  Top 0.254: T2.3 13.25,48.08 13,47.83 | T3.3 23.24,21.04 R6.2 | T1.3 31.74,18.04 R4.2 | Q5.3 43,12.58 | Q6.3 48.75,12.83 48.5,12.58 | U$2.VDD 52.52,12.6 52.5,12.58 | Q8.3 58.25,12.83 58,12.58 | Q7.3 64,12.58 | U1.P3 v44,42.33 v47.25,42.33 47.47,42.55 U1.P138 | U1.P126 53.47,42.61 v53.5,42.58 | U1.P115 58.97,42.36 v59,42.33 61,40.58 | v62,42.33 62.5,42.33 U1.P106 | U1.P91 v62.25,34.83 61,34.83 | U1.P75 62.5,26.83 62.25,26.08 | U1.P66 58.97,24.8 60,25.83 60,26.58 v60.25,26.83 60.75,27.33 61,27.33 | U1.P54 52.97,25.36 v52.75,25.58 | U1.P43 v47.47,25.36 47.47,28.3 v47.5,28.33 | U1.P34 44,26.83 | IC3.31 75.47,45.58 75.36,45.69 | IC3.4 74.72,40.05 75.5,40.83 75.5,43.91 IC3.31 | IC3.31 IC3.32 | v52,38.08 53,39.33 53,42.08 v53.5,42.58 | v47.75,38.33 45.25,38.33 45,39.83 | 53.25,42.33 v53.5,42.58 | U1.P19 v44,34.33 45.25,34.33 | v25,31.83 25,25.83 22.75,23.58 | IC2.8 76.32,30.01 | 76.32,30.01 v75,31.33 | 76.32,30.01 76.32,31.64 76.5,31.83 80.5,31.83 81.5,30.83 81.5,22.83 | IC1.18 IC1.19 IC1.20 83.39,22.72 83.5,22.83 | C26.1 82.9,22.93 83,22.83
  Top 0.6: 93.25,39.58 93.11,39.72 SV1.4 SV1.3
  Top 0.7: 45.25,34.33 45.25,38.33 45.25,41.08 v44,42.33 44,43.83 42.25,45.58 36.25,45.58 36,45.58 24.75,45.58 21.5,48.83 19.5,48.83 18.5,49.83 | 45.25,28.33 v44,27.33 44,26.83 44,25.33 43.5,24.83 43,24.83 40.5,22.33 31.5,22.33 30.5,21.33 | v62,27.83 61,27.83 | 61,27.83 61,34.33 | 61,34.33 61,34.83 61,40.58 61,40.83 62.5,42.33 62.5,43.83 63,44.33 63,46.33 64,47.33 64,53.63 R37.2 R38.2 | 61,27.83 61,27.33 62.25,26.08 62.25,25.58 63.52,24.31 SV2.6 69.98,24.31 70,24.33 | 79.25,52.08 81,52.08 84.25,52.08 84.75,51.58 84.75,49.58 87.8,46.53 R55.1 R56.1 92.05,46.53 93.25,45.33 93.25,39.58 93.25,18.08 92,16.83 88.5,16.83 85.5,19.83 85.5,20.83 83.5,22.83 83,22.83 81.5,22.83 72,22.83 70.5,24.33 70.48,24.31 SV2.4 | 45.25,28.33 v47.5,28.33 | 45.25,34.33 45.25,28.33 | 45.25,34.33 v56.75,34.33 | v59.25,34.33 61,34.33
  Top 0.813: R42.1 R45.1 R41.1 R44.1 R40.1 20.05,54.38 19,53.33 19,50.33 18.5,49.83 17.8,49.13 R22.1 15.3,49.13 14,47.83 13,47.83 10,47.83 9.5,47.33 9.5,29.83 10.75,28.58 U$4.4 14.25,28.58 18.65,24.18 C39.+ 22.15,24.18 22.75,23.58 23.2,23.13 R6.2 30.25,21.08 31.7,19.63 R4.2 32.75,18.08 33,17.83 33,12.83 34.29,11.54 SV5.7 SV5.8 38.71,11.54 39.75,12.58 43,12.58 48.5,12.58 52.5,12.58 58,12.58 64,12.58 84.25,12.58 88.5,16.83 | R42.1 R43.1 R46.2 R36.2 R39.2 R35.2 R38.2 | SV3.1 30.57,54.2 R42.1 | R37.2 65.55,54.38 66.25,55.08 66.25,56.58 v67,57.33 | C27.1 75.36,45.69 79.25,49.58 79.25,52.08 v79.25,54.33
  Bottom 0.2: C34.1 36.5,45.83 v36.25,46.08
  Bottom 0.25: v47.25,42.33 46.25,42.33 46,42.58
  Bottom 0.254: 42.5,42.33 C9.1 v44,42.33 45.65,42.33 C12.1 45.75,42.33 46,42.58 | v53.5,42.58 53.75,42.33 C6.1 | C7.1 59.15,42.18 v59,42.33 | v62,42.33 C13.1 | v62.25,34.83 C10.1 | C8.1 60,26.83 v60.25,26.83 | v52.75,25.58 52.75,26.68 C15.1 51.35,28.33 v47.5,28.33 | v47.47,25.36 47.47,23.3 46.85,22.68 C14.1 | v44,27.33 42.85,27.33 C16.1 | v52,38.08 48,38.08 v47.75,38.33 | C11.1 v44,34.33 | U$3.4 25.45,35.28 25,34.83 v25,31.83 | v75,31.33 77,31.33 C29.1
  Bottom 0.7: C17.1 v62,27.83 | v56.75,34.33 v59.25,34.33
  Bottom 0.813: v67,57.33 77.5,57.33 79.25,55.58 v79.25,54.33
VCC5  (via drill 0.6)
  Top 0.813: X7.2 3.15,14.18 2,15.33 2,20.23 C33.+ 2.1,26.33 | 2.1,26.33 2.1,34.33 | 2.1,34.33 2.1,40.93 2.94,41.77 REG2.5.3 | REG1.2.3 2.41,34.02 2.1,34.33 | 2.1,26.33 2.16,26.27 U$4.3 9.84,22.83 15.5,22.83 17.5,20.83 17.5,15.33 v17.95,14.88 R7.2 R5.2 26.5,14.63 26.5,10.33 27.77,9.06 PWR_HDR.2 29.06,9 SV5.9 SV5.10
  Bottom 0.813: v17.95,14.88 17.95,12.18 X3.5
VCCAUX  (via drill 0.6)
  Top 0.254: 50,25.58 v49.5,25.58 | U1.P62 57,23.41 v57,26.83 57,29.58 56.62,29.95 | U1.P48 50,23.41 50,25.58 | 50,25.58 50,27.58 52.5,30.08 56.5,30.08 56.62,29.95 | U1.P134 49.47,43.61 v49.75,43.08 49.75,38.58 47.75,36.58 | U1.P120 56.47,43.86 | 57,43.33 56.47,43.8 56.47,43.86 | 56.47,43.86 v56.75,43.58 | 56.5,30.33 56.62,30.2 56.62,29.95 | 56.75,36.08 57,35.83
  Top 0.7: 56.75,36.08 v56.75,43.58 | 58,35.83 58,31.58 56.62,30.2
  Top 0.813: REG2.5.4 15.25,44.08 18.15,41.18 C40.+ 25.65,41.18 31.5,35.33 v33,35.33 | v46.5,37.08 47.25,37.08 47.75,36.58 48.5,35.83 57,35.83 58,35.83
  Bottom 0.254: v49.5,25.58 C21.1 49.5,23.83 49,23.83 48,22.83 48,20.83 47.5,20.33 41,20.33 | v57,26.83 57,24.33 58,23.83 58.1,23.93 C18.1 | v56.75,43.58 56.75,43.33 58,42.08 58,41.33 58.25,41.08 C20.1 | v49.75,43.08 49.75,41.58 49.5,41.33 49.4,41.43 C19.1 | 41,20.33 40,20.33 | 40,20.33 38.5,20.33 37.5,19.33 37.52,19.31 SV5.2 | 40.3,20.28 40,20.33 | R50.2 40.75,20.58 41,20.33
  Bottom 0.813: v33,35.33 33.5,35.33 35.25,37.08 v46.5,37.08
VCCINT  (via drill 0.5, 0.6)
  Top 0.254: U1.P61 56.5,23.41 56.5,25.08 v56,25.58 | U1.P49 50.5,23.41 50.5,25.58 | 50.5,25.58 v51.5,25.58 | U1.P133 49.97,44.36 50.75,43.58 v51,43.58 | v55.5,43.58 56,44.33 56,45.33 55.97,45.3 U1.P121 | 50.5,25.58 51.5,26.58 55.5,26.58
  Top 0.406: v33.5,23.58 31.25,23.58 31,23.83 31,33.58
  Top 0.7: v56,25.58 55.5,26.08 55.5,26.58 55.5,28.83 v55,28.83 | v55.5,37.83 v55.5,43.58
  Top 0.813: REG1.2.4 15,36.33 18.65,32.68 C42.+ 20.4,33.58 31,33.58 33,33.58 v33,33.33
  Bottom 0.254: C22.1 51.5,43.33 v51,43.58 v55.5,43.58 55.5,42.33 56,41.83 C23.1 | SV5.1 34.98,20.85 33.5,22.33 v33.5,23.58 | v56,25.58 C25.1 | C24.1 51.75,25.58 v51.5,25.58
  Bottom 0.813: 55,31.58 55,37.83 v55.5,37.83 | 55,31.58 34.75,31.58 v33,33.33 | v55,28.83 55,31.58
X3
  Top 0.254: U1.P76 66.98,27.33 SV2.5
X4
  Top 0.254: U1.P77 66.5,27.83 67,28.33 68.5,28.33 70,26.83 SV2.3
X8  (via drill 0.6)
  Top 0.254: U1.P74 v65.5,26.33
  Bottom 0.254: v65.5,26.33 66.25,25.58 71.27,25.58 SV2.1

## Text on the board
Bottom: CPCFPGA.COM rev 1 (c) 2012 Ranulf Doswell
tSilk: 2012-04-02 | CPCFPGA.COM | CPC2012 prototype | CPC2012 prototype rev 1 | (c) 2012 Ranulf Doswell | VCC GND P137 P135 P132 P130 P129 P128 P127 P123 | -FPGA-XTAL- | 2.5V | HWB | 1.2V | CPCFPGA.COM | P76 | P77 | P74 | 3.3V | laborare est aemulari | VCCINT | VCC | VCC | GND | VCCAUX | P83 P84 P85 P86 P87 TCK TDI GND VCC | MOSI SCLK MISO SEL TMS TDO TDO2 GND VCC RST | GND | P47 | #crtc | VCC | P50 | P51 | GND | VCC | 5V | 5V | 5V
_tsilk: 5V 0V